# EAGLE schematic arduino (EAGLE 7.1.0)
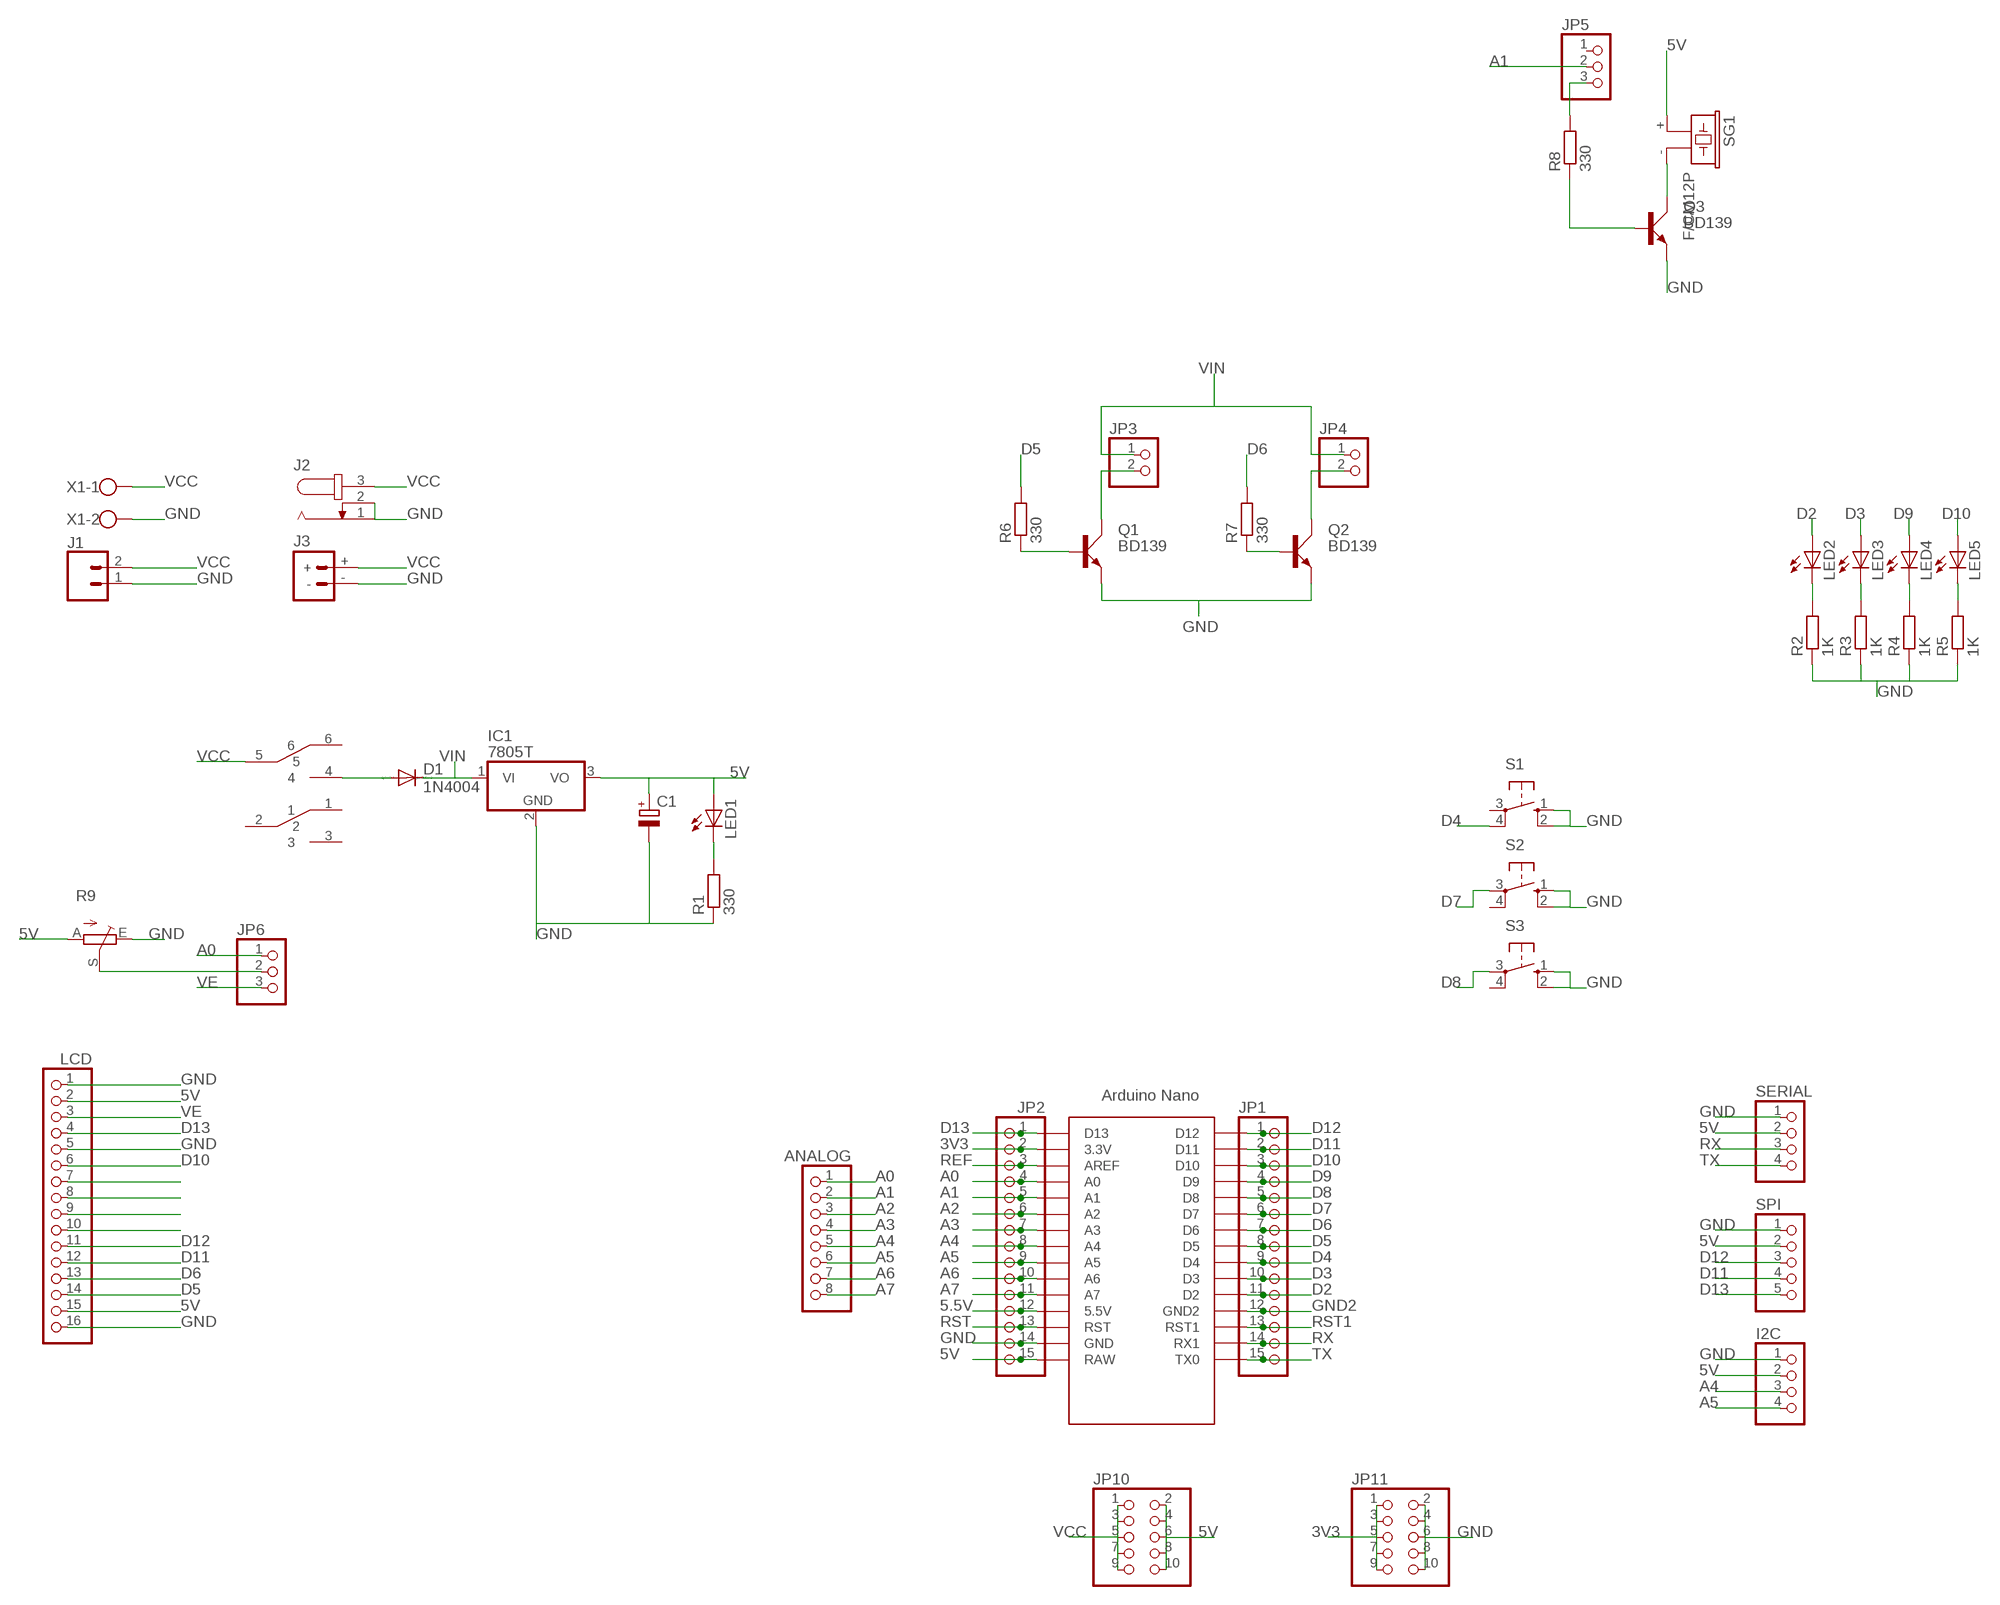
[diagram p0: schematic, sheet 1]

## Parts
ANALOG  PINHD-1X8  [1X08]
C1  CPOL-EUE5-8.5  [E5-8,5]
D1  1N4004  [DO41-10]
I2C  PINHD-1X4  [1X04]
IC1  7805T  [TO220H]
J1  CONN_02POLAR_LOCK  [MOLEX-1X2_LOCK]
J2  JACK-PLUG0  [SPC4077]
J3  BATTERY_CONN_DEANS  [DEANS]
JP1  PINHD-1X15  [1X15]
JP2  PINHD-1X15  [1X15]
JP3  PINHD-1X2  [1X02]
JP4  PINHD-1X2  [1X02]
JP5  PINHD-1X3  [1X03]
JP6  PINHD-1X3  [1X03]
JP10  PINHD-2X5  [2X05]
JP11  PINHD-2X5  [2X05]
LCD  PINHD-1X16  [1X16]
LED1  LED3MM  [LED3MM]
LED2  LED3MM  [LED3MM]
LED3  LED3MM  [LED3MM]
LED4  LED3MM  [LED3MM]
LED5  LED3MM  [LED3MM]
Q1  BD139  [TO126AV]
Q2  BD139  [TO126AV]
Q3  BD139  [TO126AV]
R1  330  R-EU_0207/7  [0207/7]
R2  1K  R-EU_0207/7  [0207/7]
R3  1K  R-EU_0207/7  [0207/7]
R4  1K  R-EU_0207/7  [0207/7]
R5  1K  R-EU_0207/7  [0207/7]
R6  330  R-EU_0207/7  [0207/7]
R7  330  R-EU_0207/7  [0207/7]
R8  330  R-EU_0207/7  [0207/7]
R9  TRIM_EU-CA6V  [CA6V]
S1  10-XX  [B3F-10XX]
S2  10-XX  [B3F-10XX]
S3  10-XX  [B3F-10XX]
SERIAL  PINHD-1X4  [1X04]
SG1  F/CM12P  [F/CM12P]
SPI  PINHD-1X5  [1X05]
U$1  NANO  [NANO]
U$2  BUTTON-DPDT-7MM  [BUTTON-DPDT-7MM]
X1  W237-102  [W237-102]

## Nets
3V3: JP2.2 JP11.1 JP11.3 JP11.5 JP11.7 JP11.9 U$1.3.3V
5.5V: JP2.12 U$1.5V(5.5V)
5V: C1.+ I2C.2 IC1.3(VO) JP2.15 JP10.2 JP10.4 JP10.6 JP10.8 JP10.10 LCD.2 LCD.15 LED1.A R9.A SERIAL.2 SG1.+ SPI.2 U$1.RAW
A0: ANALOG.1 JP2.4 JP6.1 U$1.A0
A1: ANALOG.2 JP2.5 JP5.2 U$1.A1
A2: ANALOG.3 JP2.6 U$1.A2
A3: ANALOG.4 JP2.7 U$1.A3
A4: ANALOG.5 I2C.3 JP2.8 U$1.A4
A5: ANALOG.6 I2C.4 JP2.9 U$1.A5
A6: ANALOG.7 JP2.10 U$1.A6
A7: ANALOG.8 JP2.11 U$1.A7
D2: JP1.11 LED2.A U$1.D2
D3: JP1.10 LED3.A U$1.D3
D4: JP1.9 S1.4(P1) U$1.D4
D5: JP1.8 LCD.14 R6.2 U$1.D5
D6: JP1.7 LCD.13 R7.2 U$1.D6
D7: JP1.6 S2.3(P) U$1.D7
D8: JP1.5 S3.3(P) U$1.D8
D9: JP1.4 LED4.A U$1.D9
D10: JP1.3 LCD.6 LED5.A U$1.D10
D11: JP1.2 LCD.12 SPI.4 U$1.D11
D12: JP1.1 LCD.11 SPI.3 U$1.D12
D13: JP2.1 LCD.4 SPI.5 U$1.D13
GND: C1.- I2C.1 IC1.2(GND) J1.1 J2.1 J2.2 J3.- JP2.14 JP11.2 JP11.4 JP11.6 JP11.8 JP11.10 LCD.1 LCD.5 LCD.16 Q1.E Q2.E Q3.E R1.1 R2.1 R3.1 R4.1 R5.1 R9.E S1.1(S) S1.2(S1) S2.1(S) S2.2(S1) S3.1(S) S3.2(S1) SERIAL.1 SPI.1 U$1.GND X1.2
GND2: JP1.12 U$1.GND1(GND2)
N$1: D1.A U$2.4
N$2: Q3.B R8.1
N$3: LED2.K(C) R2.2
N$4: LED1.K(C) R1.2
N$5: LED3.K(C) R3.2
N$6: LED4.K(C) R4.2
N$7: LED5.K(C) R5.2
N$8: Q1.B R6.1
N$9: Q2.B R7.1
N$10: JP3.2 Q1.C
N$11: JP4.2 Q2.C
N$12: Q3.C SG1.-
N$13: JP5.3 R8.2
N$17: LCD.7
N$18: LCD.8
N$19: LCD.9
N$20: LCD.10
N$27: JP6.2 R9.S
REF: JP2.3 U$1.AREF
RST: JP2.13 U$1.RST
RST1: JP1.13 U$1.RST1
RX: JP1.14 SERIAL.3 U$1.RX1
TX: JP1.15 SERIAL.4 U$1.TX0
VCC: J1.2 J2.3 J3.+ JP10.1 JP10.3 JP10.5 JP10.7 JP10.9 U$2.5 X1.1
VE: JP6.3 LCD.3
VIN: D1.C IC1.1(VI) JP3.1 JP4.1
Unconnected: JP5.1 S1.3(P) S2.4(P1) S3.4(P1) U$1.ICSP1 U$1.ICSP2 U$1.ICSP3 U$1.ICSP4 U$1.ICSP5 U$1.ICSP6 U$2.1 U$2.2 U$2.3 U$2.6

## Library data of the parts
ANALOG = pinhead:PINHD-1X8: PIN HEADER
C1 = rcl:CPOL-EU: POLARIZED CAPACITOR, European symbol
D1 = diode:1N4004: DIODE general purpose rectifier, 1 A
I2C SERIAL = pinhead:PINHD-1X4: PIN HEADER
IC1 = linear:78*: Positive VOLTAGE REGULATOR Source: http://cache.national.com/ds/LM/LM78L05.pdf http://www.fairchildsemi.com/ds/LM/LM7805.pdf
J1 = SparkFun-Connectors:CONN_02: Multi connection point. Often used as Generic Header-pin footprint for 0.1 inch spaced/style header connections On any of the 0.1 inch spaced packages, you can populate with these: Break Away Headers - Straight <https://www.sparkfun.com/products/116> (PRT-00116) Break Away Male Headers - Right Angle <https://www.sparkfun.com/products/553> (PRT-00553) Female Headers <https://www.sparkfun.com/products/115> (PRT-00115) Break Away Headers - Machine Pin <https://www.sparkfun.com/products/117> (PRT-00117) Break Away Female Headers - Swiss Machine Pin <https://www.sparkfun.com/products/743> (PRT-00743) For SCREWTERMINALS and SPRING TERMINALS visit here: Screw Terimnals on SparkFun.com <https://www.sparkfun.com/search/results?term=Screw+Terminals> (5mm/3.5mm/2.54mm spacing) This device is also useful as a general connection point to wire up your design to another part of your project. Our various solder wires solder well into these plated through hole pads. Hook-Up Wire - Assortment (Stranded, 22 AWG) <https://www.sparkfun.com/products/11375> (PRT-11375) Hook-Up Wire - Assortment (Solid Core, 22 AWG) <https://www.sparkfun.com/products/11367> (PRT-11367) View the entire wire category on our website here <https://www.sparkfun.com/categories/141> Special notes: Molex polarized connector foot print use with: PRT-08233 with associated crimp pins and housings. 2.54_SCREWTERM for use with PRT-10571. 3.5mm Screw Terminal footprints for PRT-08084 5mm Screw Terminal footprints for use with PRT-08432; SF_ID: PRT-09918
J2 = con-jack:JACK-PLUG: DC POWER JACK Power Jack, DC, Right Angle, Through Hole, Rated 5A at 16VDC, PC Terminals Distributor: Farnell (www.Farnell.de) Drawing: 84N1161.pdf / 84N1162.pdf Manufacturer: SPC Technology (www.spctechnology.com) Type: SPC4077 / SPC 4078; OC_FARNELL: unknown; OC_NEWARK: unknown
J3 = SparkFun-Connectors:BATTERY_CONN: Battery Connectors Various footprints for battery connections SparkFun Products: Deans Connector -M/F Pair <https://www.sparkfun.com/products/11864>; SF_ID: PRT-11864
JP1 JP2 = pinhead:PINHD-1X15: PIN HEADER
JP3 JP4 = pinhead:PINHD-1X2: PIN HEADER
JP5 JP6 = pinhead:PINHD-1X3: PIN HEADER
JP10 JP11 = pinhead:PINHD-2X5: PIN HEADER
LCD = pinhead:PINHD-1X16: PIN HEADER
LED1-LED5 = led:LED: LED OSRAM: - CHIPLED LG R971, LG N971, LY N971, LG Q971, LY Q971, LO R971, LY R971 LH N974, LH R974 LS Q976, LO Q976, LY Q976 LO Q996 - Hyper CHIPLED LW Q18S LB Q993, LB Q99A, LB R99A - SideLED LS A670, LO A670, LY A670, LG A670, LP A670 LB A673, LV A673, LT A673, LW A673 LH A674 LY A675 LS A676, LA A676, LO A676, LY A676, LW A676 LS A679, LY A679, LG A679 - Hyper Micro SIDELED® LS Y876, LA Y876, LO Y876, LY Y876 LT Y87S - SmartLED LW L88C, LW L88S LB L89C, LB L89S, LG L890 LS L89K, LO L89K, LY L89K LS L896, LA L896, LO L896, LY L896 - TOPLED LS T670, LO T670, LY T670, LG T670, LP T670 LSG T670, LSP T670, LSY T670, LOP T670, LYG T670 LG T671, LOG T671, LSG T671 LB T673, LV T673, LT T673, LW T673 LH T674 LS T676, LA T676, LO T676, LY T676, LB T676, LH T676, LSB T676, LW T676 LB T67C, LV T67C, LT T67C, LS T67K, LO T67K, LY T67K, LW E67C LS E67B, LA E67B, LO E67B, LY E67B, LB E67C, LV E67C, LT E67C LW T67C LS T679, LY T679, LG T679 LS T770, LO T770, LY T770, LG T770, LP T770 LB T773, LV T773, LT T773, LW T773 LH T774 LS E675, LA E675, LY E675, LS T675 LS T776, LA T776, LO T776, LY T776, LB T776 LHGB T686 LT T68C, LB T68C - Hyper Mini TOPLED® LB M676 - Mini TOPLED Santana® LG M470 LS M47K, LO M47K, LY M47K Source: http://www.osram.convergy.de LUXEON: - LUMILED® LXK2-PW12-R00, LXK2-PW12-S00, LXK2-PW14-U00, LXK2-PW14-V00 LXK2-PM12-R00, LXK2-PM12-S00, LXK2-PM14-U00 LXK2-PE12-Q00, LXK2-PE12-R00, LXK2-PE12-S00, LXK2-PE14-T00, LXK2-PE14-U00 LXK2-PB12-K00, LXK2-PB12-L00, LXK2-PB12-M00, LXK2-PB14-N00, LXK2-PB14-P00, LXK2-PB14-Q00 LXK2-PR12-L00, LXK2-PR12-M00, LXK2-PR14-Q00, LXK2-PR14-R00 LXK2-PD12-Q00, LXK2-PD12-R00, LXK2-PD12-S00 LXK2-PH12-R00, LXK2-PH12-S00 LXK2-PL12-P00, LXK2-PL12-Q00, LXK2-PL12-R00 Source: www.luxeon.com KINGBRIGHT: KA-3528ASYC Source: www.kingbright.com
Q1-Q3 = transistor-power:BD139: NPN TRANSISTOR
R1-R8 = rcl:R-EU_: RESISTOR, European symbol
R9 = pot:TRIM_EU-: POTENTIOMETER
S1-S3 = switch-omron:10-XX: OMRON SWITCH; MPN: B3F-1000; OC_FARNELL: 176432; OC_NEWARK: 36M3542
SG1 = buzzer:F/CM12P: BUZZER Source: Buerklin; OC_FARNELL: unknown; OC_NEWARK: unknown
SPI = pinhead:PINHD-1X5: PIN HEADER
U$1 = Arduino-clone:NANO: Arduino Nano
U$2 = button-dpdt-7mm:BUTTON-DPDT-7MM
X1 = con-wago-500:W237-102: WAGO SCREW CLAMP; MPN: 237-102; OC_FARNELL: unknown; OC_NEWARK: 70K9898